# Altium schematic sheet link.SchDoc
size A4
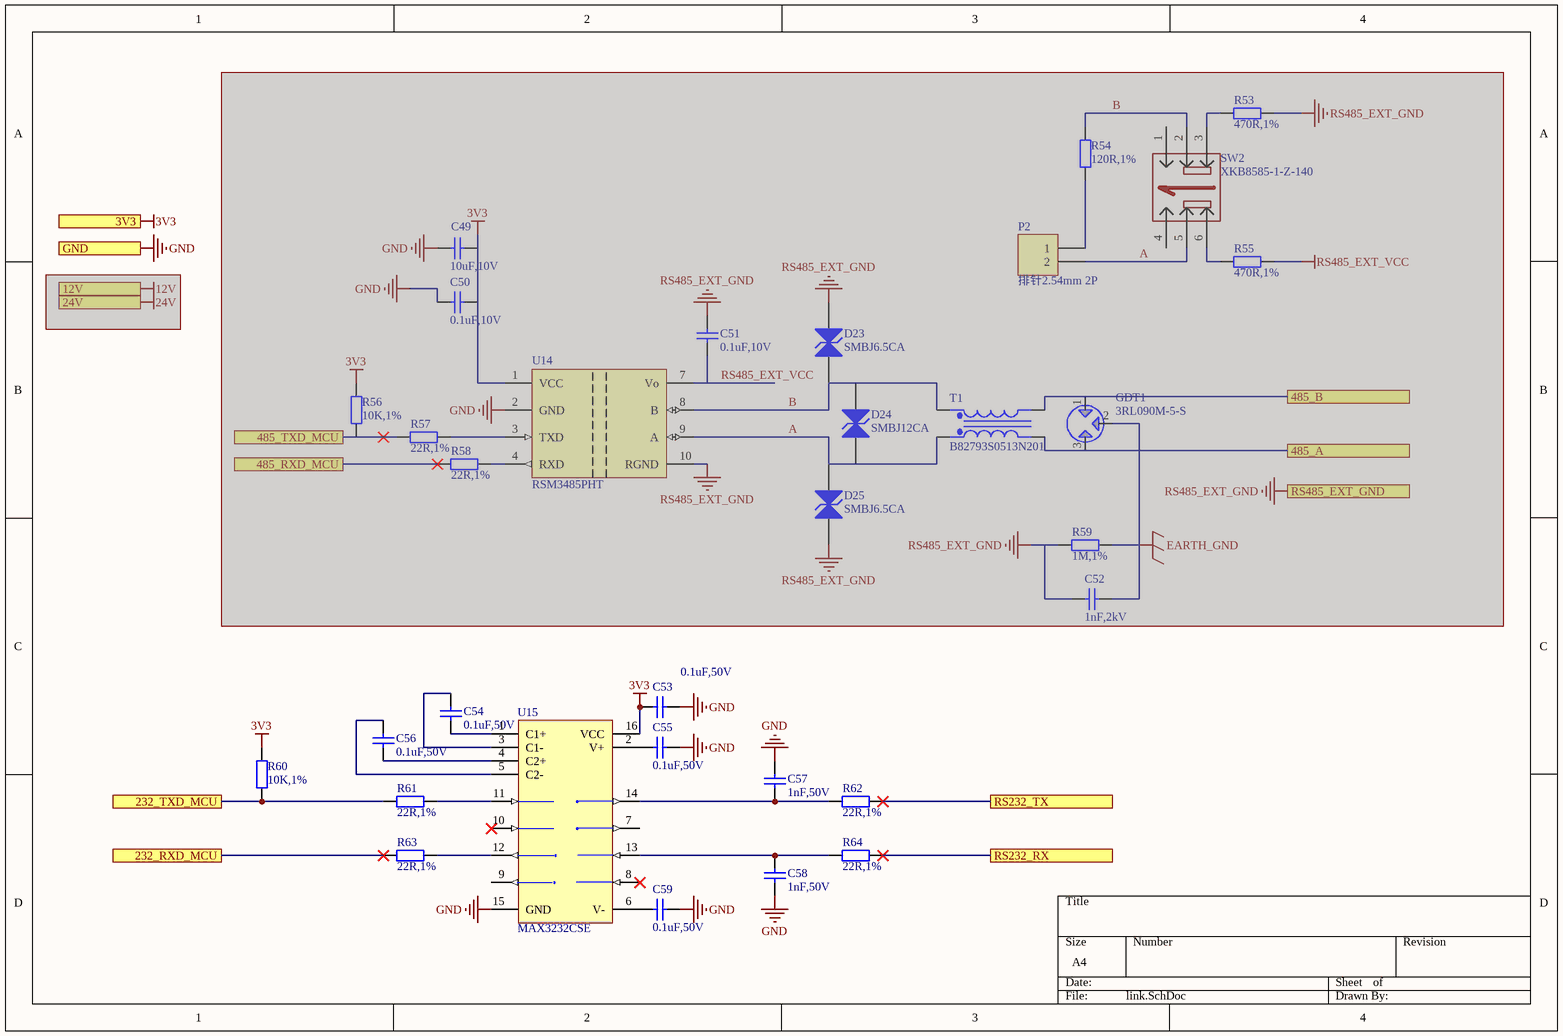
[diagram p0: link.SchDoc]

## Parts
C49  10uF,10V  [C0603]  (masked out: inside a compile mask, not in the netlist)
C50  0.1uF,10V  [C0603]  (masked out: inside a compile mask, not in the netlist)
C51  0.1uF,10V  [C0603]  (masked out: inside a compile mask, not in the netlist)
C52  1nF,2kV  [C1206]  (masked out: inside a compile mask, not in the netlist)
C53  0.1uF,50V  [C0603]
C54  0.1uF,50V  [C0603]
C55  0.1uF,50V  [C0603]
C56  0.1uF,50V  [C0603]
C57  1nF,50V  [C0603]
C58  1nF,50V  [C0603]
C59  0.1uF,50V  [C0603]
D23  SMBJ6.5CA  [SMB_L4.6-W3.6-LS5.3-BI]  (masked out: inside a compile mask, not in the netlist)
D24  SMBJ12CA  [SMB_L4.6-W3.6-LS5.3-BI]  (masked out: inside a compile mask, not in the netlist)
D25  SMBJ6.5CA  [SMB_L4.6-W3.6-LS5.3-BI]  (masked out: inside a compile mask, not in the netlist)
GDT1  3RL090M-5-S  [DIO-DT-SMD_L7.2-W5.0]  (masked out: inside a compile mask, not in the netlist)
P2  排针2.54mm 2P  [HDR1X2]  (masked out: inside a compile mask, not in the netlist)
R53  470R,1%  [R0603]  (masked out: inside a compile mask, not in the netlist)
R54  120R,1%  [R0603]  (masked out: inside a compile mask, not in the netlist)
R55  470R,1%  [R0603]  (masked out: inside a compile mask, not in the netlist)
R56  10K,1%  [R0603]  (masked out: inside a compile mask, not in the netlist)
R57  22R,1%  [R0603]  (masked out: inside a compile mask, not in the netlist)
R58  22R,1%  [R0603]  (masked out: inside a compile mask, not in the netlist)
R59  1M,1%  [R1206]  (masked out: inside a compile mask, not in the netlist)
R60  10K,1%  [R0603]
R61  22R,1%  [R0603]
R62  22R,1%  [R0603]
R63  22R,1%  [R0603]
R64  22R,1%  [R0603]
SW2  XKB8585-1-Z-140  [SW-TH_6P-L8.6-W8.6-P2.50-LS5.4]  (masked out: inside a compile mask, not in the netlist)
T1  B82793S0513N201  [FILTER-SMD_4P-L9.0-W6.0_B82790]  (masked out: inside a compile mask, not in the netlist)
U14  RSM3485PHT  [COMM-TH_RSM3485PHT]  (masked out: inside a compile mask, not in the netlist)
U15  MAX3232CSE  [NSO16_N]

## Ports
3V3, 12V, 24V, 232_RXD_MCU, 232_TXD_MCU, 485_A, 485_B, 485_RXD_MCU, 485_TXD_MCU, GND, RS232_RX, RS232_TX, RS485_EXT_GND

## Nets
3V3: C53.2 R60.2 U15.16(VCC) ; port 3V3
GND: C53.1 C55.1 C57.2 C58.2 C59.1 U15.15(GND) ; port GND
232_RXD_MCU: R63.1 ; port 232_RXD_MCU
232_TXD_MCU: R60.1 R61.1 ; port 232_TXD_MCU
RS232_RX: R64.2 ; port RS232_RX
RS232_TX: R62.2 ; port RS232_TX
NetC54_1: C54.1 U15.1(C1+)
NetC54_2: C54.2 U15.3(C1-)
NetC55_2: C55.2 U15.2(V+)
NetC56_1: C56.1 U15.4(C2+)
NetC56_2: C56.2 U15.5(C2-)
NetC57_1: C57.1 R62.1 U15.14(T1OUT)
NetC58_1: C58.1 R64.1 U15.13(R1IN)
NetC59_2: C59.2 U15.6(V-)
NetR61_2: R61.2 U15.11(T1IN)
NetR63_2: R63.2 U15.12(R1OUT)

Not connected (* = marked no-connect by the designer): U15 7(T2OUT) 8(R2IN)* 9(R2OUT) 10(T2IN)*

## Library data of the parts
C49-C59 = 无极电容: Value: 104, 16V; Type: 贴片电容
D23-D25 = SMBJ12CA: Transient Voltage  Suppressors (TVS)
GDT1 = 3RL090M-5-S: Gas Discharge Tube
P2 = Header 2: Header, 2-Pin; LatestRevisionDate: 17-Jul-2002; LatestRevisionNote: Re-released for DXP Platform.; Publisher: Altium Limited
R53-R64 = 电阻: Value: 3.3K, 10%; Type: 贴片电阻
SW2 = XKB8585-1-Z-140: 按键开关 六脚 外扣 有声自锁
T1 = B82793S0513N201: 共模电感，电感 @ 频率：51uH @ 100kHz ，直流电阻（DCR）（最大） 140mΩ
U14 = RSM3485PHT: 隔离485
U15 = MAX3232CSE: 3.0V TO 5.5V, Low-Power, up to 1Mbps, True RS-232 Transceiver Using Four 0.1礔 External Capacitor; Published: 16-Jan-2001; LatestRevisionDate: 13-Apr-2006; LatestRevisionNote: IPC-7351 Footprint Added.; DatasheetVersion: Mar-1999; PackageReference: NSO16; Publisher: Altium Limited; PackageDescription: 16-Pin Small Outline Integrated Circuit 1.27 mm Pitch; Code_JEDEC: MS-012-AC; Code_IPC: SOIC127P600-16; ComponentLink1Description: Manufacturer Link; ComponentLink1URL: http://www.maxim-ic.com/; ComponentLink2Description: Datasheet; ComponentLink2URL: http://pdfserv.maxim-ic.com/en/ds/MAX3222-MAX3241.pdf